# Altium project FAT41.PrjPCB
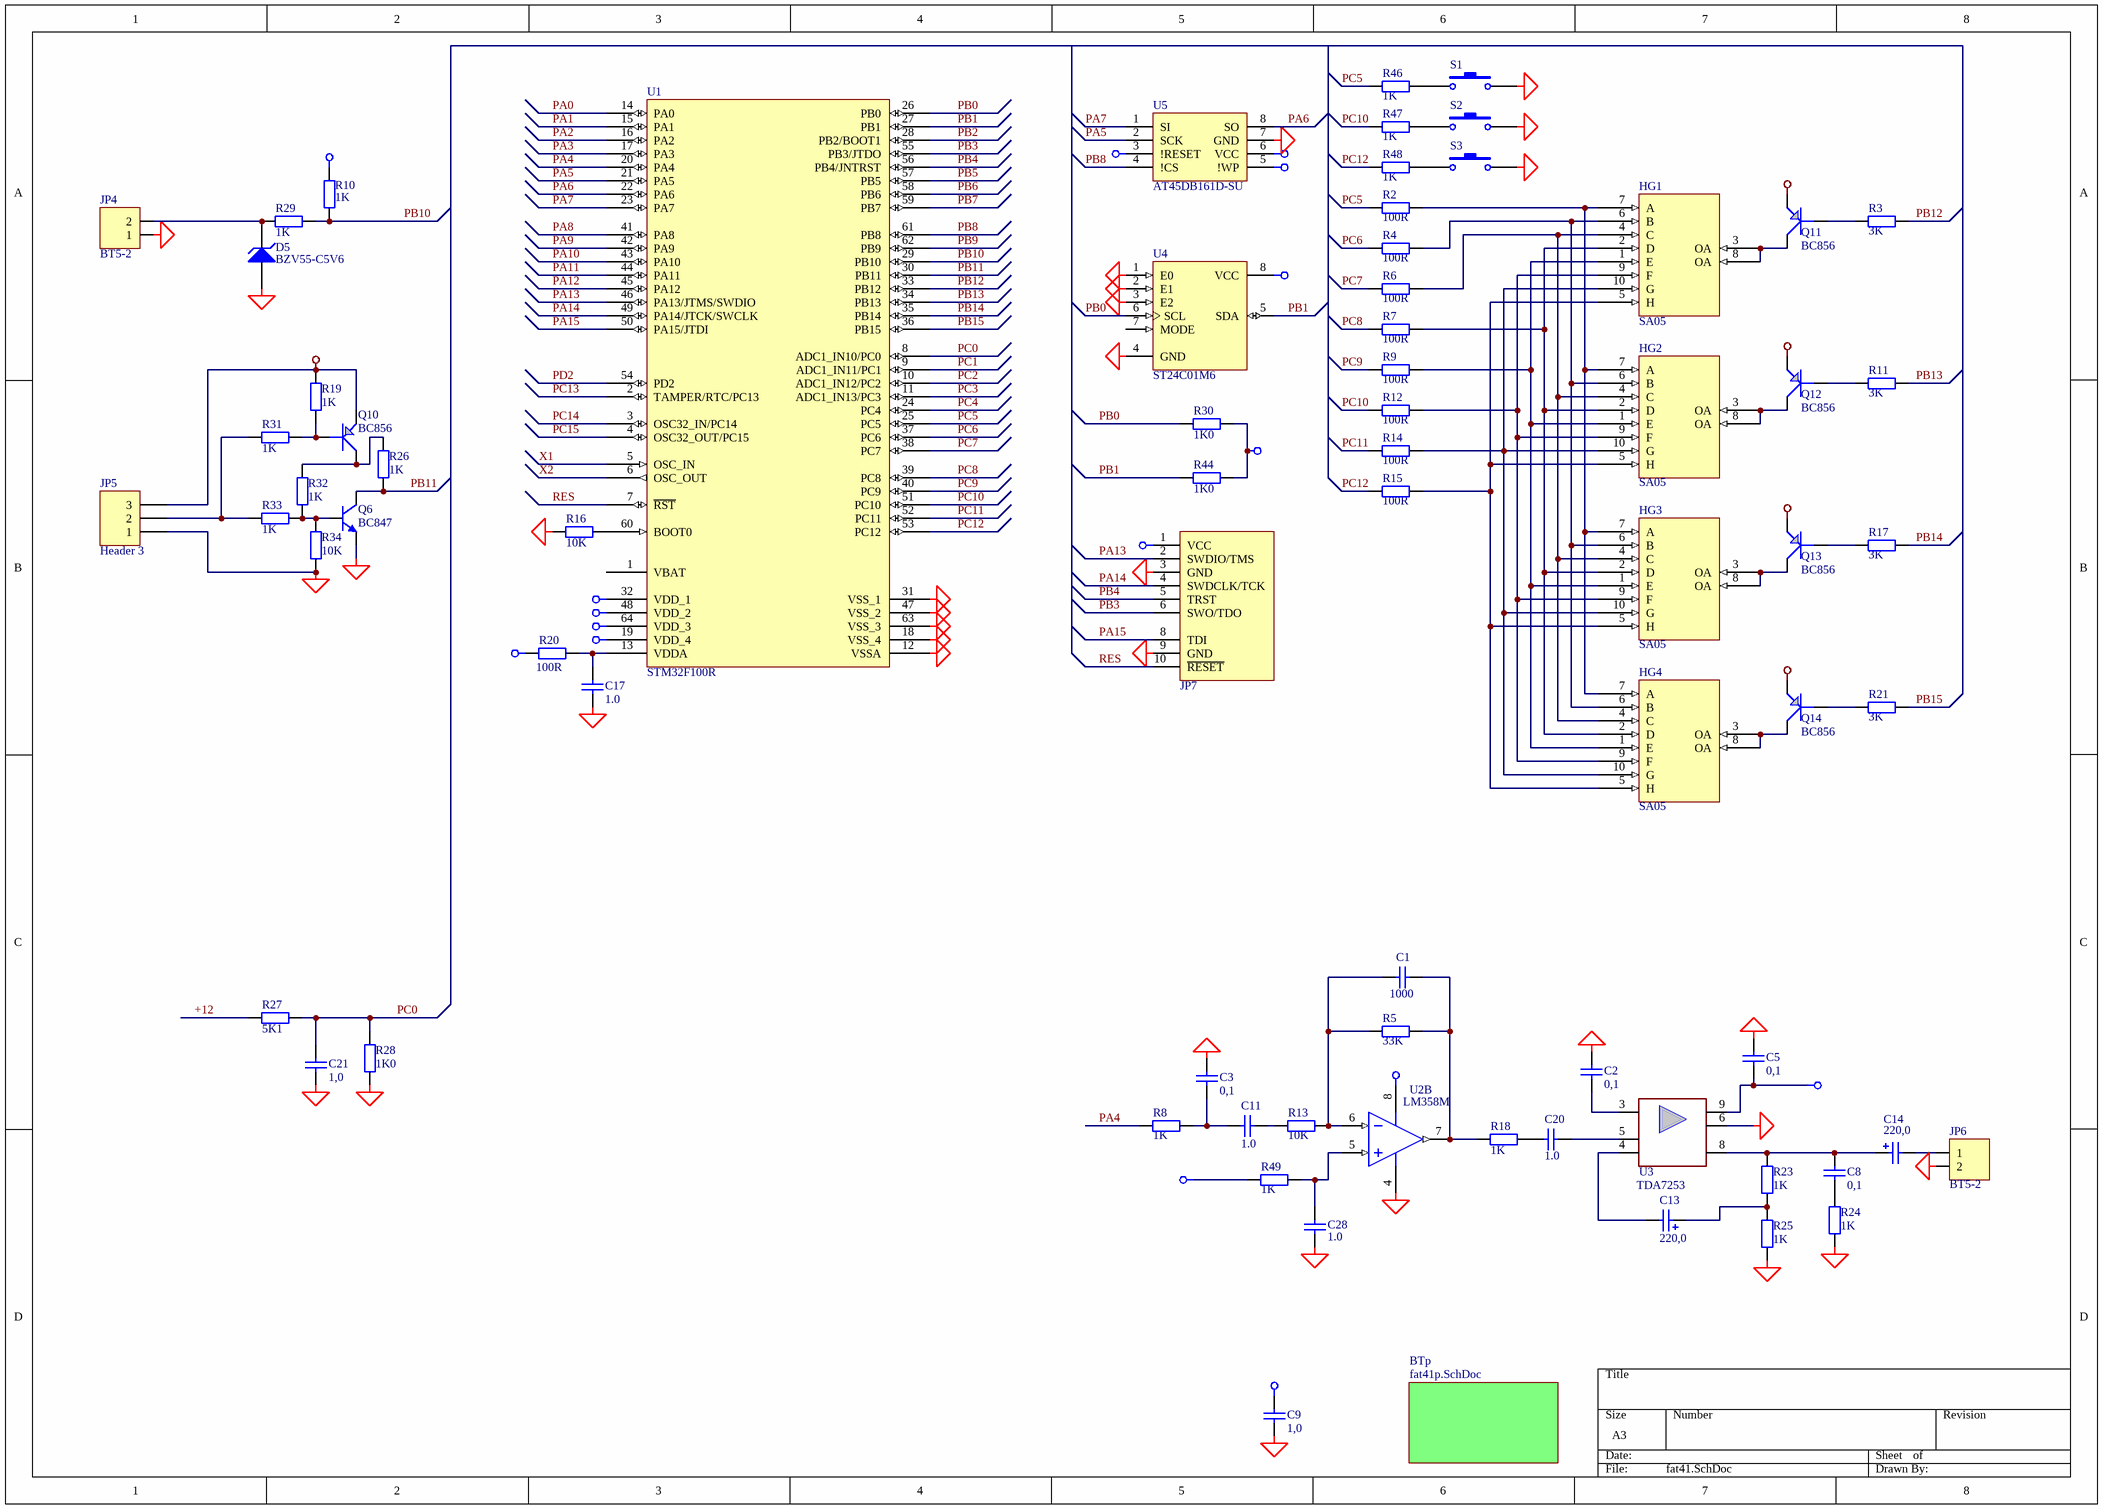
[diagram p0: fat41.SchDoc]
2 sheets, 102 parts. Net scope: global (net labels, ports and power ports of the same name join across sheets).
Board file: FAT41.PCBDOC
Sheets:
  fat41.SchDoc
    BTp = fat41p.SchDoc

## Sheet fat41.SchDoc
size A3

### Parts
C1  value 1000  [_1206]  (hidden comment: Cap Semi)
C2  value 0,1  [C3216-1206]  (hidden comment: Cap Semi)
C3  value 0,1  [_1206]  (hidden comment: Cap Semi)
C5  value 0,1  [C3216-1206]  (hidden comment: Cap Semi)
C8  value 0,1  [C3216-1206]  (hidden comment: Cap Semi)
C9  value 1,0  [C3216-1206]  (hidden comment: Cap Semi)
C11  value 1.0  [_1206]  (hidden comment: Cap Semi)
C13  value 220,0  [el3]  (hidden comment: Cap Pol1)
C14  value 220,0  [el5]  (hidden comment: Cap Pol1)
C17  1.0  [_1206]
C20  value 1.0  [_1206]  (hidden comment: Cap Semi)
C21  value 1,0  [_1206]  (hidden comment: Cap Semi)
C28  value 1.0  [_1206]  (hidden comment: Cap Semi)
D5  BZV55-C5V6  [_1206d]
HG1  SA05  [DIP10]
HG2  SA05  [DIP10]
HG3  SA05  [DIP10]
HG4  SA05  [DIP10]
JP4  BT5-2  [BT5-2-1]
JP5  Header 3  [BT5-3]
JP6  BT5-2  [BT5-2-1]
JP7  CORTEX_DEBUG_CONNECTOR_PAL  [CORTEX_DEBUG_CONNECTOR]  (value not drawn)
Q6  BC847  [SO-G3]
Q10  BC856  [SO-G3]
Q11  BC856  [SO-G3]
Q12  BC856  [SO-G3]
Q13  BC856  [SO-G3]
Q14  BC856  [SO-G3]
R2  value 100R  [_1206]  (hidden comment: Res2)
R3  value 3K  [_1206]  (hidden comment: Res2)
R4  value 100R  [_1206]  (hidden comment: Res2)
R5  value 33K  [_1206]  (hidden comment: Res2)
R6  value 100R  [_1206]  (hidden comment: Res2)
R7  value 100R  [_1206]  (hidden comment: Res2)
R8  value 1K  [_1206]  (hidden comment: Res2)
R9  value 100R  [_1206]  (hidden comment: Res2)
R10  value 1K  [_1206]  (hidden comment: Res2)
R11  value 3K  [_1206]  (hidden comment: Res2)
R12  value 100R  [_1206]  (hidden comment: Res2)
R13  value 10K  [_1206]  (hidden comment: Res2)
R14  value 100R  [_1206]  (hidden comment: Res2)
R15  value 100R  [_1206]  (hidden comment: Res2)
R16  10K  [_1206]
R17  value 3K  [_1206]  (hidden comment: Res2)
R18  value 1K  [_1206]  (hidden comment: Res2)
R19  value 1K  [_1206]  (hidden comment: Res2)
R20  100R  [_1206]
R21  value 3K  [_1206]  (hidden comment: Res2)
R23  value 1K  [_1206]  (hidden comment: Res2)
R24  value 1K  [_1206]  (hidden comment: Res2)
R25  value 1K  [_1206]  (hidden comment: Res2)
R26  value 1K  [_1206]  (hidden comment: Res2)
R27  value 5K1  [_1206]  (hidden comment: Res2)
R28  value 1K0  [_1206]  (hidden comment: Res2)
R29  value 1K  [_1206]  (hidden comment: Res2)
R30  1K0  [_1206]
R31  value 1K  [_1206]  (hidden comment: Res2)
R32  value 1K  [_1206]  (hidden comment: Res2)
R33  value 1K  [_1206]  (hidden comment: Res2)
R34  value 10K  [_1206]  (hidden comment: Res2)
R44  1K0  [_1206]
R46  value 1K  [_1206]  (hidden comment: Res2)
R47  value 1K  [_1206]  (hidden comment: Res2)
R48  value 1K  [_1206]  (hidden comment: Res2)
R49  value 1K  [_1206]  (hidden comment: Res2)
S1  SWT-6  [SWT-6-9]  (value not drawn)
S2  SWT-6  [SWT-6-9]  (value not drawn)
S3  SWT-6  [SWT-6-9]  (value not drawn)
U1  STM32F100R  [F-QFP10X10-G64/N]
U2  LM358M  [SO-G8]  (part B of 2)
U3  TDA7253  [Clipwatt11]
U4  ST24C01M6  [SO-G8]
U5  AT45DB161D-SU  [at45w]

### Sub-sheets
BTp = fat41p.SchDoc: no entries

### Nets
+3v3: C9.2 JP7.1(VCC) Q11.2(E) Q12.2(E) Q13.2(E) Q14.2(E) R10.1 R20.2 R30.2 R44.2 R49.2 U1.19(VDD_4) U1.32(VDD_1) U1.48(VDD_2) U1.64(VDD_3) U4.8(VCC) U5.3(!RESET) U5.5(!WP) U5.6(VCC)
+12v: C5.1 JP5.3 Q10.2(E) R19.2 U2.8(V+) U3.9
GND: C2.2 C3.2 C5.2 C9.1 C17.2 C21.1 C28.2 D5.1(A) JP4.1 JP5.1 JP6.2 JP7.3(GND) JP7.9(GND) Q6.2(E) R16.1 R24.1 R25.1 R28.2 R34.2 S1.2 S2.2 S3.2 U1.12(VSSA) U1.18(VSS_4) U1.31(VSS_1) U1.47(VSS_2) U1.63(VSS_3) U2.4(GND) U3.6 U4.1(E0) U4.2(E1) U4.3(E2) U4.4(GND) U5.7(GND)
+12: R27.2
PA0: U1.14(PA0)
PA1: U1.15(PA1)
PA2: U1.16(PA2)
PA3: U1.17(PA3)
PA4: R8.2 U1.20(PA4)
PA5: U1.21(PA5) U5.2(SCK)
PA6: U1.22(PA6) U5.8(SO)
PA7: U1.23(PA7) U5.1(SI)
PA8: U1.41(PA8)
PA9: U1.42(PA9)
PA10: U1.43(PA10)
PA11: U1.44(PA11)
PA12: U1.45(PA12)
PA13: JP7.2(SWDIO/TMS) U1.46(PA13/JTMS/SWDIO)
PA14: JP7.4(SWDCLK/TCK) U1.49(PA14/JTCK/SWCLK)
PA15: JP7.8(TDI) U1.50(PA15/JTDI)
PB0: R30.1 U1.26(PB0) U4.6(SCL)
PB1: R44.1 U1.27(PB1) U4.5(SDA)
PB2: U1.28(PB2/BOOT1)
PB3: JP7.6(SWO/TDO) U1.55(PB3/JTDO)
PB4: JP7.5(TRST) U1.56(PB4/JNTRST)
PB5: U1.57(PB5)
PB6: U1.58(PB6)
PB7: U1.59(PB7)
PB8: U1.61(PB8) U5.4(!CS)
PB9: U1.62(PB9)
PB10: R10.2 R29.1 U1.29(PB10)
PB11: Q6.3(C) R26.2 U1.30(PB11)
PB12: R3.2 U1.33(PB12)
PB13: R11.2 U1.34(PB13)
PB14: R17.2 U1.35(PB14)
PB15: R21.2 U1.36(PB15)
PC0: C21.2 R27.1 R28.1 U1.8(ADC1_IN10/PC0)
PC1: U1.9(ADC1_IN11/PC1)
PC2: U1.10(ADC1_IN12/PC2)
PC3: U1.11(ADC1_IN13/PC3)
PC4: U1.24(PC4)
PC5: R2.1 R46.1 U1.25(PC5)
PC6: R4.1 U1.37(PC6)
PC7: R6.1 U1.38(PC7)
PC8: R7.1 U1.39(PC8)
PC9: R9.1 U1.40(PC9)
PC10: R12.1 R47.1 U1.51(PC10)
PC11: R14.1 U1.52(PC11)
PC12: R15.1 R48.1 U1.53(PC12)
PC13: U1.2(TAMPER/RTC/PC13)
PC14: U1.3(OSC32_IN/PC14)
PC15: U1.4(OSC32_OUT/PC15)
PD2: U1.54(PD2)
RES: JP7.10(~{RESET}) U1.7(~{RST})
X1: U1.5(OSC_IN)
X2: U1.6(OSC_OUT)
NetC1_1: C1.1 R5.1 R18.1 U2.7(OUT)
NetC1_2: C1.2 R5.2 R13.1 U2.6(IN-)
NetC2_1: C2.1 U3.3(MUTE)
NetC3_1: C3.1 C11.1 R8.1
NetC8_1: C8.1 R24.2
NetC8_2: C8.2 C14.1 R23.2 U3.8
NetC11_2: C11.2 R13.2
NetC13_1: C13.1 R23.1 R25.2
NetC13_2: C13.2 U3.4
NetC14_2: C14.2 JP6.1
NetC17_1: C17.1 R20.1 U1.13(VDDA)
NetC20_1: C20.1 R18.2
NetC20_2: C20.2 U3.5(+)
NetC28_1: C28.1 R49.1 U2.5(IN+)
NetD5_2: D5.2(K) JP4.2 R29.2
NetHG1_1: HG1.1(E) HG2.1(E) HG3.1(E) HG4.1(E) R9.2
NetHG1_2: HG1.2(D) HG2.2(D) HG3.2(D) HG4.2(D) R7.2
NetHG1_3: HG1.3(OA) HG1.8(OA) Q11.3(C)
NetHG1_4: HG1.4(C) HG2.4(C) HG3.4(C) HG4.4(C) R6.2
NetHG1_5: HG1.5(H) HG2.5(H) HG3.5(H) HG4.5(H) R15.2
NetHG1_6: HG1.6(B) HG2.6(B) HG3.6(B) HG4.6(B) R4.2
NetHG1_7: HG1.7(A) HG2.7(A) HG3.7(A) HG4.7(A) R2.2
NetHG1_9: HG1.9(F) HG2.9(F) HG3.9(F) HG4.9(F) R12.2
NetHG1_10: HG1.10(G) HG2.10(G) HG3.10(G) HG4.10(G) R14.2
NetHG2_3: HG2.3(OA) HG2.8(OA) Q12.3(C)
NetHG3_3: HG3.3(OA) HG3.8(OA) Q13.3(C)
NetHG4_3: HG4.3(OA) HG4.8(OA) Q14.3(C)
NetJP5_2: JP5.2 R31.2 R33.2
NetQ6_1: Q6.1(B) R32.2 R33.1 R34.1
NetQ10_1: Q10.1(B) R19.1 R31.1
NetQ10_3: Q10.3(C) R26.1 R32.1
NetQ11_1: Q11.1(B) R3.1
NetQ12_1: Q12.1(B) R11.1
NetQ13_1: Q13.1(B) R17.1
NetQ14_1: Q14.1(B) R21.1
NetR16_2: R16.2 U1.60(BOOT0)
NetR46_2: R46.2 S1.1
NetR47_2: R47.2 S2.1
NetR48_2: R48.2 S3.1

Not connected (* = marked no-connect by the designer): U1 1(VBAT); U4 7(MODE)

### Library data of the parts
C1-C3 C5 C8 C9 C11 C20 C21 C28 = Cap Semi: Capacitor (Semiconductor SIM Model); Manufacturer: Generic Components; Class I: Passive; Published: 8-Jun-2000; Revision: July-2002: Re-released for DXP Platform.; Publisher: Altium Limited; Class II: Capacitor
C13 C14 = Cap Pol1: Polarized Capacitor (Radial); Manufacturer: Generic Components; Class I: Passive; Published: 8-Jun-2000; Revision: July-2002: Re-released for DXP Platform.; Publisher: Altium Limited; Class II: Capacitor
C17 = Cap Semi: Capacitor (Semiconductor SIM Model); Manufacturer: Generic Components; Class I: Passive; Value: 0,1; Published: 8-Jun-2000; Revision: July-2002: Re-released for DXP Platform.; Publisher: Altium Limited; Class II: Capacitor
D5 = D Zener: Zener Diode; Manufacturer: Generic Components; Class I: Discrete; Class II: Diode - Zener; Published: 8-Jun-2000; Revision: July-2002: Re-released for DXP Platform.; Publisher: Altium Limited
HG1-HG4 = SA05: Right: 60; Bottom: 90
JP4 JP6 = BT5-2: Header, 3-Pin; Manufacturer: Generic Components; Class I: Connector; Revision: July-2002: Re-released for DXP Platform.; Publisher: Altium Limited
JP5 = Header 3: Header, 3-Pin; Manufacturer: Generic Components; Class I: Connector; Revision: July-2002: Re-released for DXP Platform.; Publisher: Altium Limited
Q6 = BC847ALT1: General Purpose Transistor NPN Silicon; Manufacturer: Motorola; Package Information: Latest Revision: 1997; Class I: Discrete; Class II: BJT - Low Power; Published: 29-Sep-2000; Revision: July-2002: Re-released for DXP Platform.; Datasheet: Latest Revision: 1997; Package Reference: 318-08; Publisher: Altium Limited
Q10-Q14 = GT109: Right: 20; Bottom: 20
R2-R4 R6 R7 R9 R11 R12 R14 R15 R17 R19 R21 R23-R26 R46-R48 = RES: Resistor; Manufacturer: Generic Components; Class I: Passive; Published: 8-Jun-2000; Revision: July-2002: Re-released for DXP Platform.; Publisher: Altium Limited; Class II: Resistor
R5 R8 R10 R13 R18 R27-R29 R31-R34 R49 = Res2: Resistor; Manufacturer: Generic Components; Class I: Passive; Published: 8-Jun-2000; Revision: July-2002: Re-released for DXP Platform.; Publisher: Altium Limited; Class II: Resistor
R16 R30 R44 = RES: Resistor; Manufacturer: Generic Components; Class I: Passive; Value: 1K; Published: 8-Jun-2000; Revision: July-2002: Re-released for DXP Platform.; Publisher: Altium Limited; Class II: Resistor
R20 = Res2: Resistor; Manufacturer: Generic Components; Class I: Passive; Value: 1K; Published: 8-Jun-2000; Revision: July-2002: Re-released for DXP Platform.; Publisher: Altium Limited; Class II: Resistor
S1-S3 = SWT-6: Switch; Manufacturer: Generic Components; Published: 24-Mar-1999; Revision: July-2002: Re-released for DXP Platform.; Publisher: Altium Limited
U1 = STM32F100R: STM32 ARM-based 32-bit MCU with 64 Kbytes Flash, 64-pin LQFP, Industrial Temperature; Published: *; DatasheetVersion: *; PackageVersion: *; PackageReference: *; Publisher: *; PackageDescription: *; ComponentLink1Description: *; ComponentLink1URL: *; ComponentLink2Description: *; ComponentLink2URL: *
U2 = LM358M: Low-Power Dual Operational Amplifier; Manufacturer: National Semiconductor; Package Information: Latest Revision: Sep-1997; Published: 15-Apr-2002; Datasheet: Latest Revision: Sep-1999; Package Reference: M08A; Publisher: Altium Limited; Class I: Amplifier; Class II: Operational Amplifier
U4 = ST24C01M6: Serial 1K (128 x 8) EEPROM; Manufacturer: ST-Microelectronics; Package Information: Latest Revision: Jul-1999; Class I: Memory; Published: 24-Aug-2001; Revision: July-2002: Re-released for DXP Platform.; Datasheet: Latest Revision: Nov-1997; Package Reference: SOP8; Publisher: Altium Limited; Class II: EEPROM

## Sheet fat41p.SchDoc
size A4
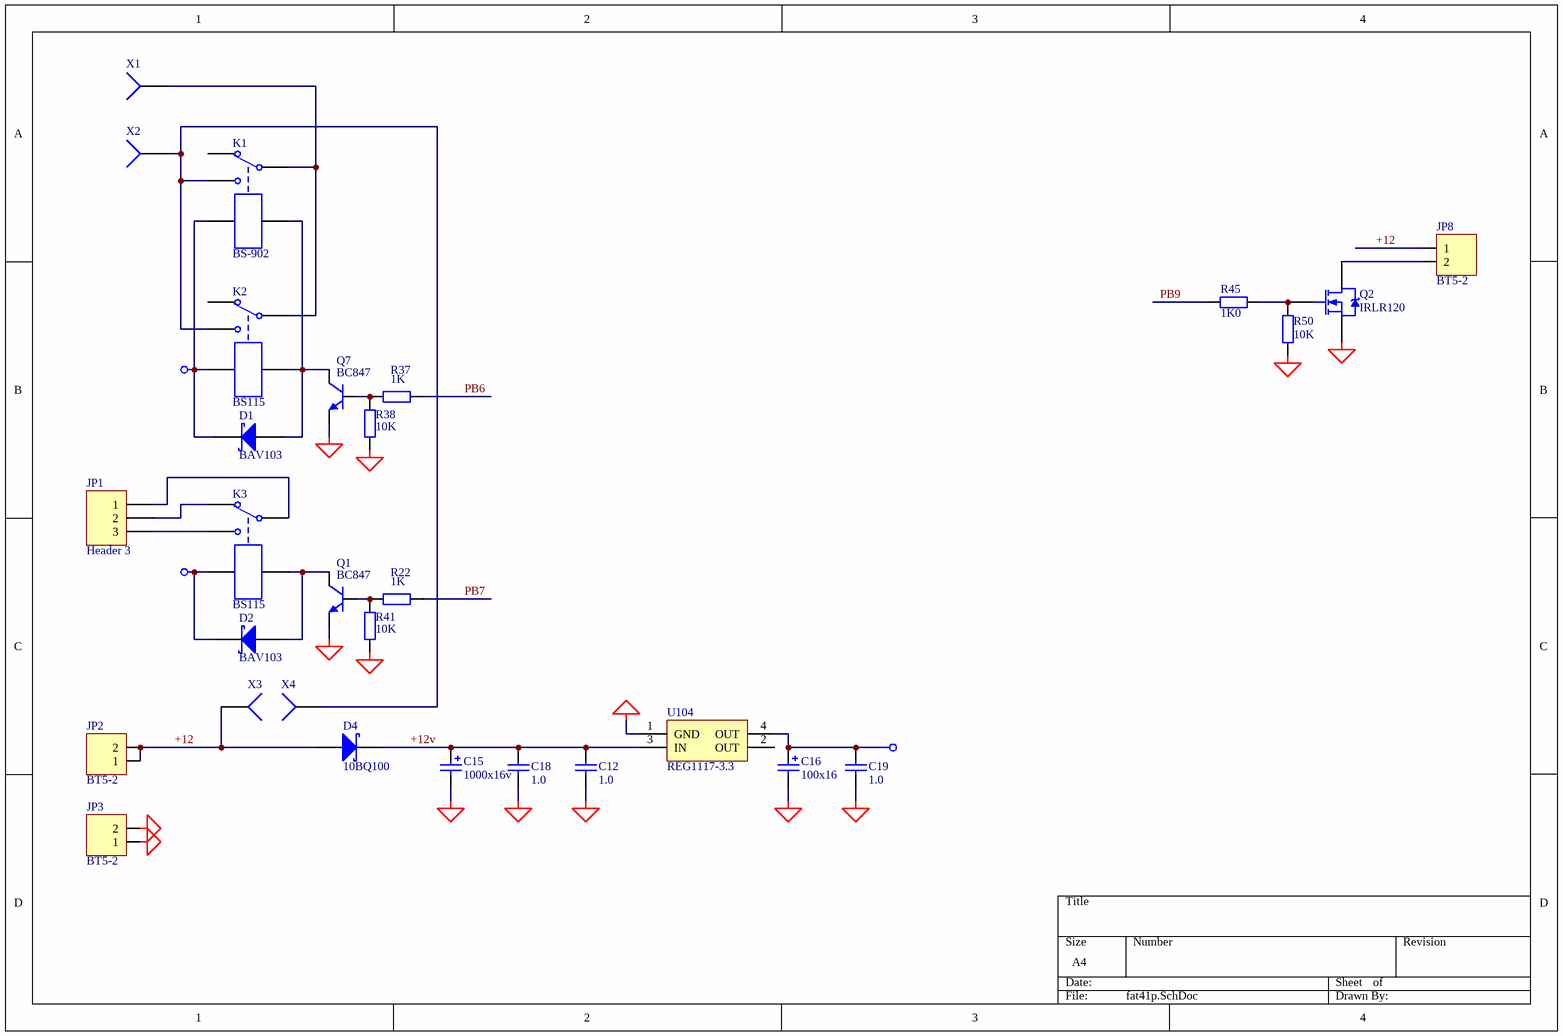
[diagram p1: fat41p.SchDoc]

### Parts
C12  value 1.0  [_1206]  (hidden comment: Cap)
C15  value 1000x16v  [el5]
C16  value 100x16  [el3]
C18  value 1.0  [_1206]  (hidden comment: Cap)
C19  value 1.0  [_1206]  (hidden comment: Cap)
D1  BAV103  [_1206d]
D2  BAV103  [_1206d]
D4  10BQ100  [DSO-C2/X2.3]
JP1  Header 3  [BT5-3]
JP2  BT5-2  [BT5-2-1]
JP3  BT5-2  [BT5-2-1]
JP8  BT5-2  [BT5-2-1]
K1  BS-902  [BS-902]
K2  BS115  [BS115]
K3  BS115  [BS115]
Q1  BC847  [SO-G3]
Q2  IRLR120  [SIP-G3/E8]
Q7  BC847  [SO-G3]
R22  value 1K  [_1206]  (hidden comment: Res2)
R37  value 1K  [_1206]  (hidden comment: Res2)
R38  value 10K  [_1206]  (hidden comment: Res2)
R41  value 10K  [_1206]  (hidden comment: Res2)
R45  1K0  [_1206]
R50  10K  [_1206]
U104  REG1117-3.3  [SIP-G3/C7.4]
X1  (no value)  [PIN3]
X2  (no value)  [PIN3]
X3  (no value)  [PIN1]
X4  (no value)  [PIN1]

### Nets
+3v3: C16.1 C19.2 U104.4(OUT)
+12v: C12.2 C15.1 C18.2 D1.2(K) D2.2(K) D4.2(K) K1.5 K2.5 K3.5 U104.3(IN)
GND: C12.1 C15.2 C16.2 C18.1 C19.1 JP3.1 JP3.2 Q1.2(E) Q2.3(S) Q7.2(E) R38.2 R41.2 R50.2 U104.1(GND)
+12: D4.1(A) JP2.1 JP2.2 JP8.1 X3.1
PB6: R37.2
PB7: R22.2
PB9: R45.1
NetD1_1: D1.1(A) K1.4 K2.4 Q7.3(C)
NetD2_1: D2.1(A) K3.4 Q1.3(C)
NetJP1_1: JP1.1 K3.1
NetJP1_2: JP1.2 K3.2
NetJP1_3: JP1.3 K3.3
NetJP8_2: JP8.2 Q2.4(D)
NetK1_1: K1.1 K2.1 X1.1
NetK1_3: K1.3 K2.3 X2.1 X4.1
NetQ1_1: Q1.1(B) R22.1 R41.1
NetQ2_1: Q2.1(G) R45.2 R50.1
NetQ7_1: Q7.1(B) R37.1 R38.1

Not connected (* = marked no-connect by the designer): K1 2; K2 2; U104 2(OUT)

### Library data of the parts
C12 C18 C19 = Cap: Capacitor; Manufacturer: Generic Components; Class I: Passive; Published: 8-Jun-2000; Revision: July-2002: Re-released for DXP Platform.; Publisher: Altium Limited; Class II: Capacitor
C15 = Cap Pol1: as C13 on sheet fat41; Published: 8-Jun-2000; Revision: July-2002: Re-released for DXP Platform.; Publisher: Altium Limited; Class II: Capacitor
C16 = Cap Pol: Polarized Capacitor (Radial); Manufacturer: Generic Components; Class I: Passive; Published: 8-Jun-2000; Revision: July-2002: Re-released for DXP Platform.; Publisher: Altium Limited; Class II: Capacitor
D1 D2 D4 = 10BQ015: Schottky Rectifier; Manufacturer: International Rectifier; Revision 1: 10-July-2000: SIM Model Added.; Revision 2: July-2002: Re-released for DXP Platform.; Class I: Discrete; Class II: Rectifier - Schottky; Published: 8-Jun-2000; Datasheet: Latest Revision: PD-2.396A; Package Reference: DO-214AA; Publisher: Altium Limited
JP1 = Header 3: as JP5 on sheet fat41; Revision: July-2002: Re-released for DXP Platform.; Publisher: Altium Limited
JP2 JP3 JP8 = BT5-2: as JP4 on sheet fat41; Revision: July-2002: Re-released for DXP Platform.; Publisher: Altium Limited
K1-K3 = BS115: Single-Pole Dual-Throw Relay; Manufacturer: Generic Components; Class I: Electro-mechanical; Published: 24-Mar-1999; Revision: July-2002: Re-released for DXP Platform.; Publisher: Altium Limited; Class II: Relay
Q1 Q7 = BC847ALT1: as Q6 on sheet fat41; Published: 29-Sep-2000; Revision: July-2002: Re-released for DXP Platform.; Datasheet: Latest Revision: 1997; Package Reference: 318-08; Publisher: Altium Limited
Q2 = IRFR120: HEXFET N-Channel Power MOSFET; Manufacturer: International Rectifier; Revision 1: 10-July-2000: SIM Model Added.; Revision 2: July-2002: Re-released for DXP Platform.; Class I: Discrete; Class II: MOSFET - Power; Note: Pin 2 is trimmed and is electrically connected to Drain.; Published: 8-Jun-2000; Datasheet: Latest Revision: PD-9.523D; Package Reference: TO-252AA; Publisher: Altium Limited
R22 R37 R38 R41 = Res2: as R5 on sheet fat41; Published: 8-Jun-2000; Revision: July-2002: Re-released for DXP Platform.; Publisher: Altium Limited; Class II: Resistor
R45 R50 = Res2: as R20 on sheet fat41; Published: 8-Jun-2000; Revision: July-2002: Re-released for DXP Platform.; Publisher: Altium Limited; Class II: Resistor
U104 = REG1117-3.3: 800mA and 1A Low Dropout Positive Regulator 2.85V, 3.3V, 5V, and Adjustable; Manufacturer: Burr-Brown; Package Information: Latest Revision: Rev. C; Class I: Power Management; Class II: Voltage Regulator; Published: 8-Jun-2000; Revision: July-2002: Re-released for DXP Platform.; Datasheet: Latest Revision: Sep-1997; Package Reference: ZZ311; Publisher: Altium Limited
X1-X4 = Socket: Manufacturer: Generic Components; Class I: Connector; Revision: July-2002: Re-released for DXP Platform.; Publisher: Altium Limited

## Nets that join several sheets
+3v3: fat41 (19 pins), fat41p (C16.1 C19.2 U104.4)
+12v: fat41 (6 pins), fat41p (10 pins)
GND: fat41 (34 pins), fat41p (14 pins)
+12: fat41 (R27.2), fat41p (5 pins)
PB6: fat41 (U1.58), fat41p (R37.2)
PB7: fat41 (U1.59), fat41p (R22.2)
PB9: fat41 (U1.62), fat41p (R45.1)